# EAGLE schematic tappytap (EAGLE 7.3.0)
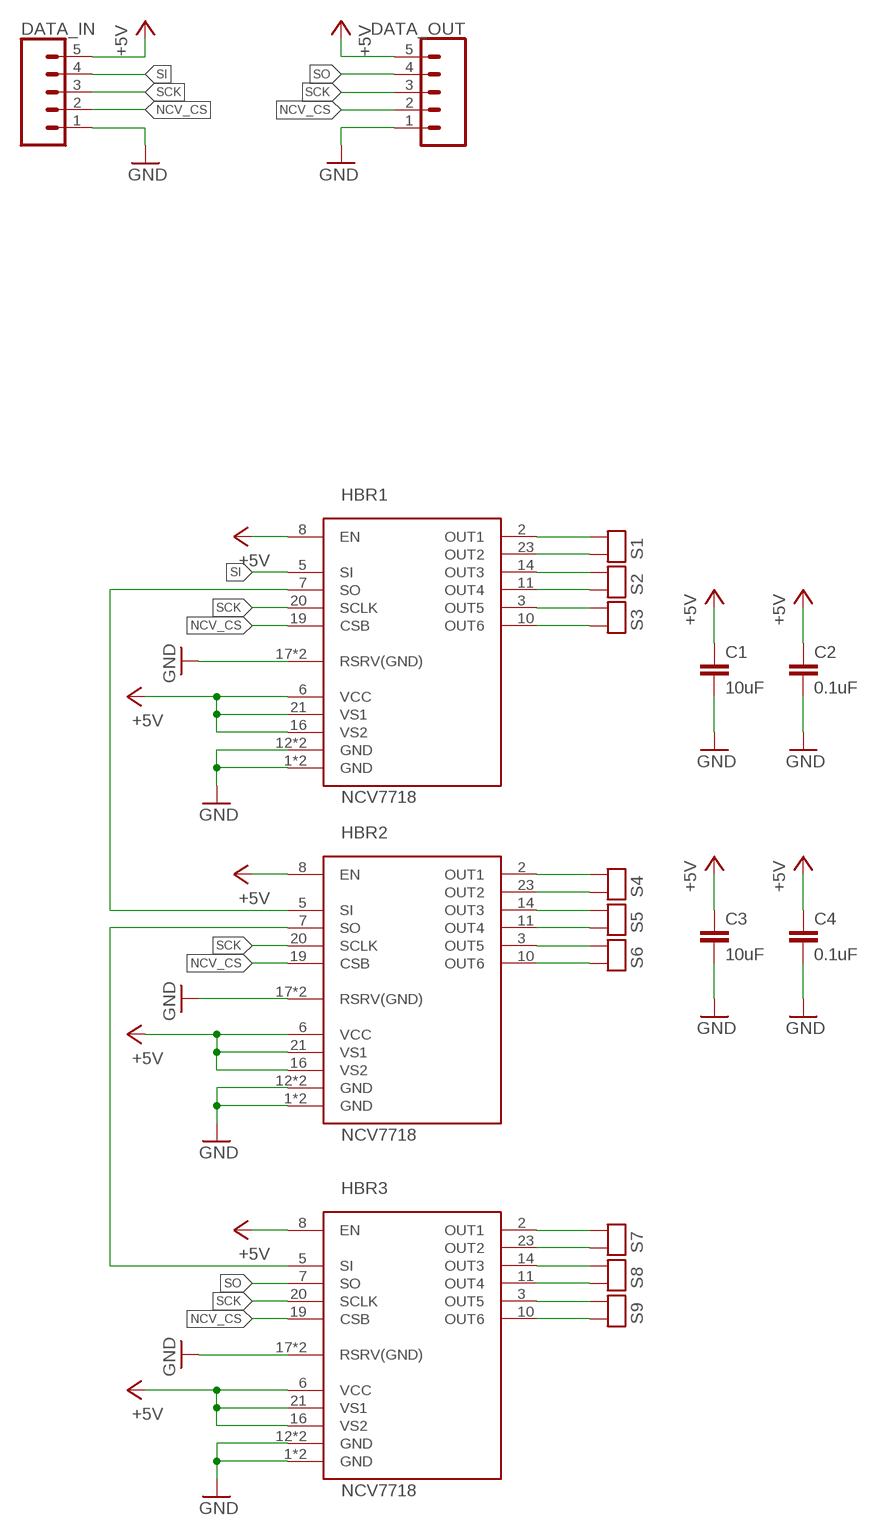
[diagram p0: schematic, sheet 1]

## Parts
C1  10uF  C-EUC0603  [C0603]
C2  0.1uF  C-EUC0603  [C0603]
C3  10uF  C-EUC0603  [C0603]
C4  0.1uF  C-EUC0603  [C0603]
DATA_IN  CONN_05  [1X05]
DATA_OUT  CONN_05  [1X05]
HBR1  NCV7718  [SSOP-24]
HBR2  NCV7718  [SSOP-24]
HBR3  NCV7718  [SSOP-24]
S1  TP2  [TP2_2MM]
S2  TP2  [TP2_2MM]
S3  TP2  [TP2_2MM]
S4  TP2  [TP2_2MM]
S5  TP2  [TP2_2MM]
S6  TP2  [TP2_2MM]
S7  TP2  [TP2_2MM]
S8  TP2  [TP2_2MM]
S9  TP2  [TP2_2MM]

## Nets
+5V [usbvcc]: C1.1 C2.1 C3.1 C4.1 DATA_IN.5 DATA_OUT.5 HBR1.6(VCC) HBR1.8(EN) HBR1.16(VS2) HBR1.21(VS1) HBR2.6(VCC) HBR2.8(EN) HBR2.16(VS2) HBR2.21(VS1) HBR3.6(VCC) HBR3.8(EN) HBR3.16(VS2) HBR3.21(VS1)
GND [gnd]: C1.2 C2.2 C3.2 C4.2 DATA_IN.1 DATA_OUT.1 HBR1.1(GND) HBR1.12(GND) HBR1.13(GND) HBR1.17(RSRV(GND)) HBR1.18(RSRV(GND)) HBR1.24(GND) HBR2.1(GND) HBR2.12(GND) HBR2.13(GND) HBR2.17(RSRV(GND)) HBR2.18(RSRV(GND)) HBR2.24(GND) HBR3.1(GND) HBR3.12(GND) HBR3.13(GND) HBR3.17(RSRV(GND)) HBR3.18(RSRV(GND)) HBR3.24(GND)
N$24: HBR1.7(SO) HBR2.5(SI)
N$26: HBR2.7(SO) HBR3.5(SI)
NCV_CS: DATA_IN.2 DATA_OUT.2 HBR1.19(CSB) HBR2.19(CSB) HBR3.19(CSB)
S1A: HBR1.2(OUT1) S1.P$1
S1B: HBR1.23(OUT2) S1.P$2
S2A: HBR1.14(OUT3) S2.P$1
S2B: HBR1.11(OUT4) S2.P$2
S3A: HBR1.3(OUT5) S3.P$1
S3B: HBR1.10(OUT6) S3.P$2
S4A: HBR2.2(OUT1) S4.P$1
S4B: HBR2.23(OUT2) S4.P$2
S5A: HBR2.14(OUT3) S5.P$1
S5B: HBR2.11(OUT4) S5.P$2
S6A: HBR2.3(OUT5) S6.P$1
S6B: HBR2.10(OUT6) S6.P$2
S7A: HBR3.2(OUT1) S7.P$1
S7B: HBR3.23(OUT2) S7.P$2
S8A: HBR3.14(OUT3) S8.P$1
S8B: HBR3.11(OUT4) S8.P$2
S9A: HBR3.3(OUT5) S9.P$1
S9B: HBR3.10(OUT6) S9.P$2
SCK: DATA_IN.3 DATA_OUT.3 HBR1.20(SCLK) HBR2.20(SCLK) HBR3.20(SCLK)
SI: DATA_IN.4 HBR1.5(SI)
SO: DATA_OUT.4 HBR3.7(SO)

## Library data of the parts
C1-C4 = rcl:C-EU: CAPACITOR, European symbol
DATA_IN DATA_OUT = SparkFun-Connectors:CONN_05: Multi connection point. Often used as Generic Header-pin footprint for 0.1 inch spaced/style header connections On any of the 0.1 inch spaced packages, you can populate with these: Break Away Headers - Straight <https://www.sparkfun.com/products/116> (PRT-00116) Break Away Male Headers - Right Angle <https://www.sparkfun.com/products/553> (PRT-00553) Female Headers <https://www.sparkfun.com/products/115> (PRT-00115) Break Away Headers - Machine Pin <https://www.sparkfun.com/products/117> (PRT-00117) Break Away Female Headers - Swiss Machine Pin <https://www.sparkfun.com/products/743> (PRT-00743) For SCREWTERMINALS and SPRING TERMINALS visit here: Screw Terimnals on SparkFun.com <https://www.sparkfun.com/search/results?term=Screw+Terminals> (5mm/3.5mm/2.54mm spacing) This device is also useful as a general connection point to wire up your design to another part of your project. Our various solder wires solder well into these plated through hole pads. Hook-Up Wire - Assortment (Stranded, 22 AWG) <https://www.sparkfun.com/products/11375> (PRT-11375) Hook-Up Wire - Assortment (Solid Core, 22 AWG) <https://www.sparkfun.com/products/11367> (PRT-11367) View the entire wire category on our website here <https://www.sparkfun.com/categories/141> Special notes: Molex polarized connector foot print use with SKU : PRT-08231 with associated crimp pins and housings. 1MM SMD Version SKU: PRT-10208
HBR1-HBR3 = Sparky:NCV7718: Hex Half−Bridge Driver. The device can be operated in forward, reverse, brake, and high impedance states. The drivers are controlled via a 16 bit SPI interface and are daisy chain compatible.
S1-S9 = Sparky:TP2